# Altium schematic sheet BoardC.SchDoc
size A; SheetNumber: 9; SheetTotal: 9
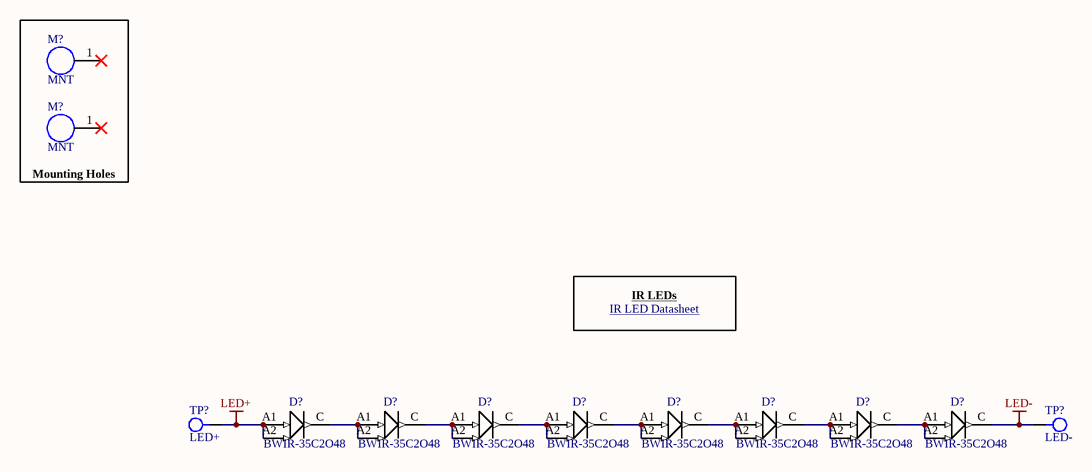
[diagram p0: BoardC.SchDoc]

## Parts
(Parts that share a designator on the sheet are numbered #1, #2 ... from top to bottom, then left to right.)
D?#1  BWIR-35C2O48
D?#2  BWIR-35C2O48
D?#3  BWIR-35C2O48
D?#4  BWIR-35C2O48
D?#5  BWIR-35C2O48
D?#6  BWIR-35C2O48
D?#7  BWIR-35C2O48
D?#8  BWIR-35C2O48
M?#1  MNT  [MNT]
M?#2  MNT  [MNT]
TP?#1  LED+
TP?#2  LED-

## Blocks framed on the sheet
Mounting Holes: M?#1 M?#2

## Nets
LED+: D?#1.A1 D?#1.A2 TP?#1.1
LED-: D?#8.C TP?#2.1
NetD?#1_C: D?#1.C D?#2.A1 D?#2.A2
NetD?#2_C: D?#2.C D?#3.A1 D?#3.A2
NetD?#3_C: D?#3.C D?#4.A1 D?#4.A2
NetD?#4_C: D?#4.C D?#5.A1 D?#5.A2
NetD?#5_C: D?#5.C D?#6.A1 D?#6.A2
NetD?#6_C: D?#6.C D?#7.A1 D?#7.A2
NetD?#7_C: D?#7.C D?#8.A1 D?#8.A2

Not connected (* = marked no-connect by the designer): M?#1 1*; M?#2 1*

## Notes on the sheet
- IR LEDs
- IR LED Datasheet <https://www.americanbrightled.com/pdffiles/ir-uv/ir/BWIR-35C2O48.pdf>

## Library data of the parts
D?#1-D?#8 = BWIR-35C2O48: Infrared (IR) Emitter 850nm 1.7V 1A 260mW/sr @ 1A (Typ) 120° 1414 (3535 Metric); Manufacturer: American Bright; Supplier 1: Digi-Key; Manufacturer Part Number: BWIR-35C2O48; RoHS: No; Stock 1: 22417; Pricing 1: 1=2.11000, 10=1.40800, 100=1.08350, 500=0.97944, 1000=0.86625 (USD); Packaging: Tape and Reel; Supplier Part Number 1: BWIR-35C2O48CT-ND
TP?#1 TP?#2 = TestPoint1mm